# Altium schematic sheet current_stabilizer.SchDoc: Stabilizer Current Sense Mezzanine
size A3; DocumentNumber: 1; SheetNumber: 1; SheetTotal: 5
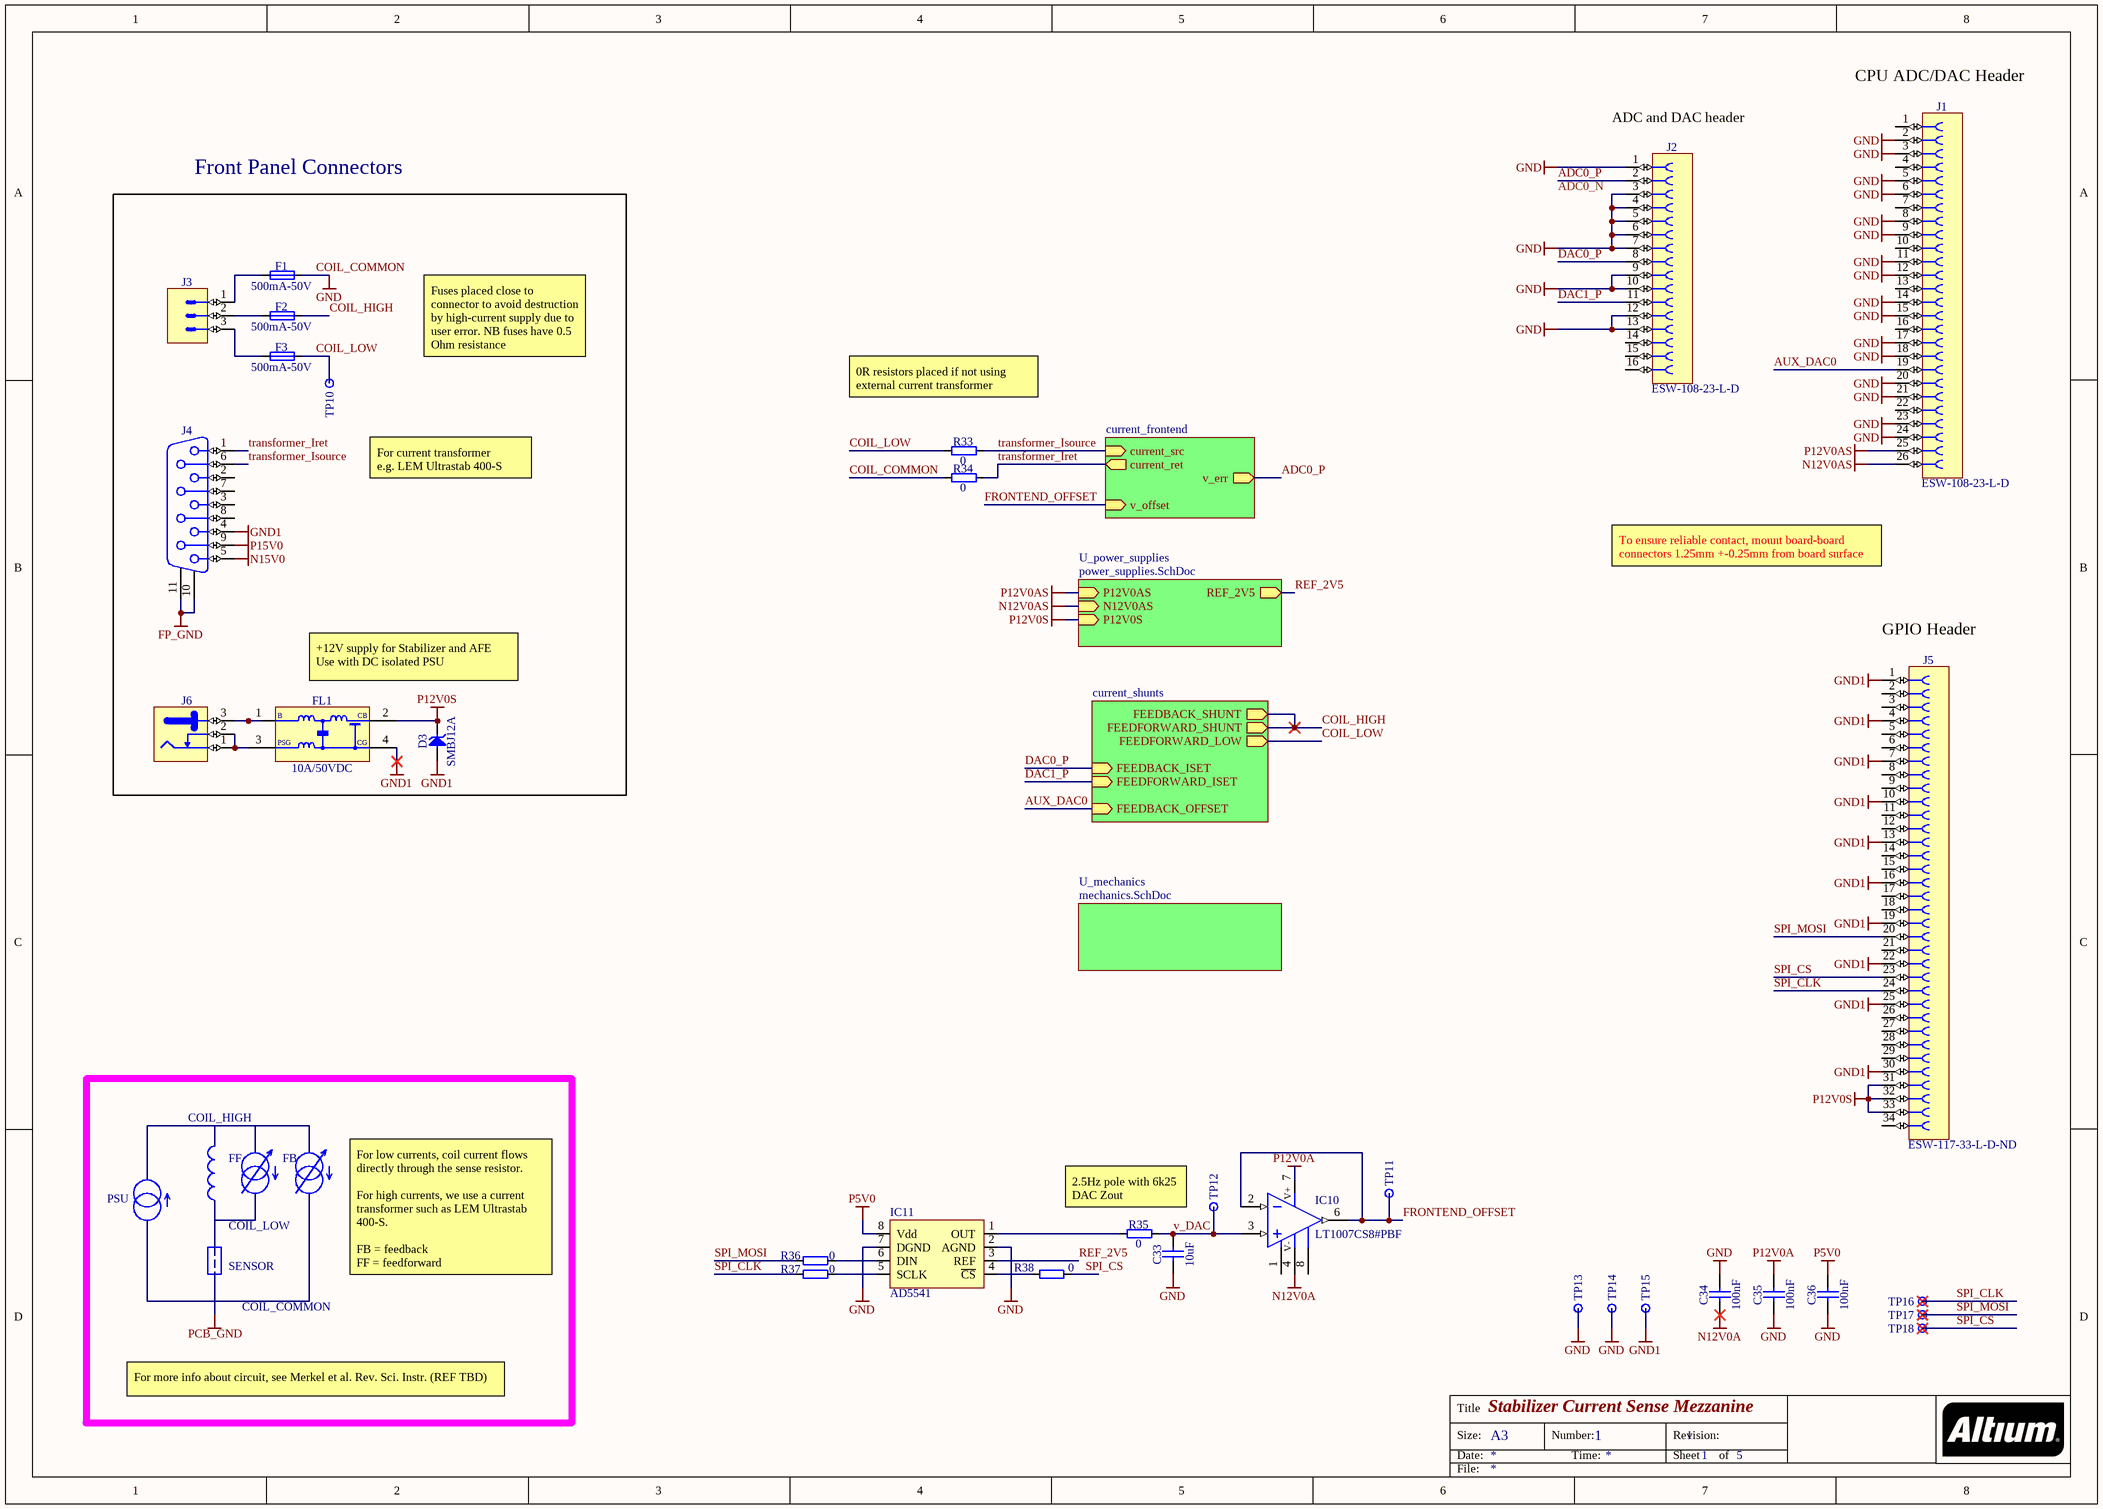
[diagram p0: current_stabilizer.SchDoc]

## Parts
C33  10uF  [CAPC2012X95N]
C34  100nF  [CAPC1608X87N]
C35  100nF  [CAPC1608X87N]
C36  100nF  [CAPC1608X87N]
D3  SMBJ12A  [DIOM5336X265N]
F1  500mA-50V  [FUSC1608X55N]
F2  500mA-50V  [FUSC1608X55N]
F3  500mA-50V  [FUSC1608X55N]
FL1  10A/50VDC  [FIL_MURATA_BNX02]
IC10  LT1007CS8#PBF  [SOIC127P600X175-8N]
IC11  AD5541  [so-8]
J1  ESW-108-23-L-D  [ESW-113-23-L-D]
J2  ESW-108-23-L-D  [ESW-108-23-L-D]
J3  MSTBA  [PHOENIX_1757255]  (value not drawn)
J4  D-Sub 9F  [FCI_D09S13A4GV00LF]  (value not drawn)
J5  Manufacturer Part Number: ESW-117-33-L-D-ND  [ESW-117-23-L-D]  (hidden comment: ESW-108-23-L-D)
J6  Jack  [SWITCHCRAFT_L712RA]  (value not drawn)
R33  0  [RESC1608X55N]
R34  0  [RESC1608X55N]
R35  0  [RESC1608X55N]
R36  0  [RESC1608X55N]
R37  0  [RESC1608X55N]
R38  0  [RESC1608X55N]
TP10  Test Point  [TPS127]  (value not drawn)
TP11  Test Point  [TPS127]  (value not drawn)
TP12  Test Point  [TPS127]  (value not drawn)
TP13  Test Point  [TPS127]  (value not drawn)
TP14  Test Point  [TPS127]  (value not drawn)
TP15  Test Point  [TPS127]  (value not drawn)
TP16  Test Point  [TPS127]  (value not drawn)
TP17  Test Point  [TPS127]  (value not drawn)
TP18  Test Point  [TPS127]  (value not drawn)

## Blocks framed on the sheet
Front Panel Connectors: D3 F1-F3 FL1 J3 J4 J6 TP10

## Sub-sheets
current_frontend = current_frontend: v_err (out), v_offset (in), current_src (in), current_ret (out)
Designator = current_shunts: FEEDFORWARD_ISET (in), FEEDBACK_ISET (in), FEEDFORWARD_SHUNT (out), FEEDBACK_SHUNT (out), FEEDBACK_OFFSET (in), FEEDFORWARD_LOW (out)
U_mechanics = mechanics.SchDoc: no entries
U_power_supplies = power_supplies.SchDoc: REF_2V5 (out), P12V0AS (in), N12V0AS (in), P12V0S (in)

## Nets
COIL_COMMON: C33.1 C34.2 C35.1 C36.1 F1.1 IC11.2(AGND) IC11.7(DGND) J1.2 J1.3 J1.5 J1.6 J1.8 J1.9 J1.11 J1.12 J1.14 J1.15 J1.17 J1.18 J1.20 J1.21 J1.23 J1.24 J2.1 J2.3 J2.4 J2.5 J2.6 J2.7 J2.9 J2.10 J2.12 J2.13 R34.1 TP13.1 TP14.1  [also labelled GND]
FP_GND: J4.10 J4.11
GND1: D3.2(A) FL1.4(CG) J4.4 J5.1 J5.4 J5.7 J5.10 J5.13 J5.16 J5.19 J5.22 J5.25 J5.30 TP15.1
N12V0A: C34.1 IC10.4(V-)
N12V0AS: J1.26 ; sheet U_power_supplies/N12V0AS
N15V0: J4.5
P5V0: C36.2 IC11.8(Vdd)
P12V0A: C35.2 IC10.7(V+)
P12V0AS: J1.25 ; sheet U_power_supplies/P12V0AS
P12V0S: D3.1(C) FL1.2(CB) J5.31 J5.32 J5.33 ; sheet U_power_supplies/P12V0S
P15V0: J4.9
ADC0_P: J2.2 ; sheet current_frontend/v_err
AUX_DAC0: J1.19 ; sheet Designator/FEEDBACK_OFFSET
COIL_HIGH: F2.1 ; sheet Designator/FEEDFORWARD_SHUNT, sheet Designator/FEEDBACK_SHUNT
COIL_LOW: F3.1 R33.1 TP10.1 ; sheet Designator/FEEDFORWARD_LOW
DAC0_P: J2.8 ; sheet Designator/FEEDBACK_ISET
DAC1_P: J2.11 ; sheet Designator/FEEDFORWARD_ISET
FRONTEND_OFFSET: IC10.2(IN-) IC10.6(OUT) TP11.1 ; sheet current_frontend/v_offset
REF_2V5: IC11.3(REF) ; sheet U_power_supplies/REF_2V5
SPI_CLK: J5.24 R37.1 TP16.1
SPI_CS: J5.23 R38.2 TP18.1
SPI_MOSI: J5.20 R36.1 TP17.1
transformer_Iret: J4.1 R34.2 ; sheet current_frontend/current_ret
transformer_Isource: J4.6 R33.2 ; sheet current_frontend/current_src
v_DAC: C33.2 IC10.3(IN+) R35.2 TP12.1
NetF1_2: F1.2 J3.1
NetF2_2: F2.2 J3.2
NetF3_2: F3.2 J3.3
NetFL1_1: FL1.1(B) J6.3
NetFL1_3: FL1.3(PSG) J6.1 J6.2
NetIC11_1: IC11.1(OUT) R35.1
NetIC11_4: IC11.4(~{CS}) R38.1
NetIC11_5: IC11.5(SCLK) R37.2
NetIC11_6: IC11.6(DIN) R36.2

Not connected (* = marked no-connect by the designer): IC10 1(OFFSET) 8(OFFSET); J1 1 4 7 10 13 16 22; J2 14 15 16; J4 2 3 7 8; J5 2 3 5 6 8 9 11 12 14 15 17 18 21 26 27 28 29 34

## Notes on the sheet
- (near J1) CPU ADC/DAC Header
- (near J2) ADC and DAC header
- ADC0_N
- Fuses placed close to connector to avoid destruction by high-current supply due to user error. NB fuses have 0.5 Ohm resistance
- 0R resistors placed if not using external current transformer
- For current transformer
  e.g. LEM Ultrastab 400-S
- To ensure reliable contact, mount board-board connectors 1.25mm +-0.25mm from board surface
- (near J5) GPIO Header
- +12V supply for Stabilizer and AFE
  Use with DC isolated PSU
- COIL_HIGH
- FF
- FB
- PSU
- COIL_LOW
- 2.5Hz pole with 6k25 DAC Zout
- SENSOR
- COIL_COMMON
- For low currents, coil current flows directly through the sense resistor.
  For high currents, we use a current transformer such as LEM Ultrastab 400-S.
  FB = feedback
  FF = feedforward
- For more info about circuit, see Merkel et al. Rev. Sci. Instr. (REF TBD)
- PCB_GND
- Title
- Size:
- Date:
- A3
- Number:
- Time:
- Revision:
- Sheet
- of
- File:

## Library data of the parts
C33 = CC0805_10UF_25V_10%_X5R: Non-polarised capacitor; Part Description: SMD Multilayer Chip Ceramic Capacitor; Manufacturer: GENERIC; Manufacturer1 Part Number: GRM219R61E106KA12D; Voltage: 25V; TC: X5R; Tolerance: ±10%; Part Number: CC0805_10UF_25V_10%_X5R; Component Kind: Standard; Component Type: Standard; Pin Count: 2; Value: 10uF; Status: Preferred; Manufacturer Part Number: CC0805_10UF_25V_10%_X5R; Case: 0805; Mounted: Yes; Socket: No; SMD: Yes; Sense: No; Manufacturer1 Example: MURATA; Manufacturer1 ComponentHeight: 0.95mm; HelpURL: \\cern.ch\dfs\Applications\Altium\Datasheets\CC0805_X5R_MURATA_GRM.pdf; Author: CERN DEM JLC; CreateDate: 25/10/2012; LatestRevisionDate: 06/09/2016
C34-C36 = CC0603_100NF_50V_10%_X7R: Non-polarised capacitor; Part Description: SMD Multilayer Chip Ceramic Capacitor; Manufacturer: GENERIC; Manufacturer1 Part Number: 223858615649; Voltage: 50V; TC: X7R; Tolerance: ±10%; Part Number: CC0603_100NF_50V_10%_X7R; Component Kind: Standard; Component Type: Standard; Pin Count: 2; Value: 100nF; Status: Preferred; Manufacturer Part Number: CC0603_100NF_50V_10%_X7R; Case: 0603; Mounted: Yes; Socket: No; SMD: Yes; Sense: No; Manufacturer1 Example: PHYCOMP; Manufacturer1 ComponentHeight: 0.87mm; HelpURL: \\cern.ch\dfs\Applications\Altium\Datasheets\CC0603_X7R_PHYCOMP.pdf; Author: CERN DEM JLC; CreateDate: 03/12/2007; LatestRevisionDate: 03/12/2007
D3 = SMBJ12A: Zener Diode; Part Description: Uni-Directional Transient Voltage Suppressor Diode; Manufacturer: FAIRCHILD SEMICONDUCTOR; Voltage: 12V; Power: 600W; PressFit: No; Bonding: No; Part Number: SMBJ12A; Component Kind: Standard; Component Type: Standard; Device: SMBJ12A; PackageDescription: DO-214-AA/SMB Diode, Molded Body; 5.34mm L X 3.625mm W X 2.65mm H, IPC Medium Density; Manufacturer Part Number: SMBJ12A; Pin Count: 2; Case: DO-214AA; Mounted: Yes; Socket: No; SMD: Yes; Sense: No; ComponentHeight: 2.65mm; HelpURL: \\cern.ch\dfs\Applications\Altium\Datasheets\SMBJ.pdf; Author: CERN DEM JLC; CreateDate: 10/04/2013; LatestRevisionDate: 10/04/2013
F1-F3 = FUS0603_BOURNS-SF-0603F050-2: Fuse; Part Description: Thin Film Chip Fuse; Manufacturer: BOURNS; PressFit: No; Part Number: FUS0603_BOURNS-SF-0603F050-2; Component Kind: Standard; Component Type: Standard; Pin Count: 2; PackageDescription: Chip Fuse, 2-Leads, Body 1.6mm x 0.8mm, IPC Medium Density; Family: Fuse; Mounted: Yes; Socket: No; SMD: Yes; Sense: No; Value: 500mA-50V; Manufacturer Part Number: SF-0603F050-2; ComponentHeight: 0.55mm; HelpURL: \\cern.ch\dfs\Applications\Altium\Datasheets\FUSE_BOURNS_SF-0603F.pdf; Author: CERN DEM JLC; CreateDate: 01/02/2017; LatestRevisionDate: 01/02/2017
FL1 = FIL_MURATA_BNX022-01L: Block Type EMIFIL (LC Combined); Part Description: Block Type EMIFIL (LC Combined) SMD Type, BNX02* Series; Manufacturer: MURATA; Resistance: 0.5R; Part Number: FIL_MURATA_BNX022-01L; Component Kind: Standard; Component Type: Standard; Pin Count: 2; Value: 10A/50VDC; Status: None; Manufacturer Part Number: BNX022-01L; Mounted: Yes; Socket: No; SMD: Yes; Sense: No; ComponentHeight: 3.3mm; HelpURL: \\cern.ch\dfs\Applications\Altium\Datasheets\FIL_MURATA_BNX022-01L.pdf; Author: CERN DEM JLC; CreateDate: 10/10/2012; LatestRevisionDate: 10/10/2012
IC10 = LT1007CS8#PBF: Operational Amplifier with Offset 1-8; Part Description: Low Noise, High Speed Precision Operational Amplifier; Manufacturer: LINEAR TECHNOLOGY; PressFit: No; Bonding: No; Part Number: LT1007CS8#PBF; Component Kind: Standard; Component Type: Standard; Device: LT1007CS8#PBF; PackageDescription: SOIC 8, Pitch 1.27mm - Body 4x5mm, IPC Medium Density; Manufacturer Part Number: LT1007CS8#PBF; Pin Count: 7; Case: SOIC8; Mounted: Yes; Socket: No; SMD: Yes; Sense: No; ComponentHeight: 1.75mm; Author: CERN DEM JLC; HelpURL: \\cern.ch\dfs\Applications\Altium\Datasheets\LT1007CS8#PBF.pdf; CreateDate: 09/03/2011; LatestRevisionDate: 09/03/2011
IC11 = AD5541LRZ: 16 bit serial DAC; Manufacturer: ANALOG DEVICES; Manufacturer Part Number: AD5541LRZ
J1 = ESW-113-23-L-D: Connector Elevated Socket 26 POS 2.54mm, 13.59mm height; Manufacturer: Samtec; Manufacturer Part Number: ESW-108-23-L-D
J2 = ESW-108-23-L-D: Connector Elevated Socket 16 POS 2.54mm, 13.59mm height; Manufacturer: Samtec; Manufacturer Part Number: ESW-108-23-L-D
J3 = PHOENIX_1757255: Connector 3 Male; Part Description: 12A, 250V, Pitch 5.08mm, 3 Positions Header; Manufacturer: PHOENIX CONTACT; Manufacturer Part Number: 1757255 (MSTBA 2,5/ 3-G-5,08); PressFit: No; Part Number: PHOENIX_1757255; Component Kind: Standard; Component Type: Standard; Pin Count: 3; Mounted: Yes; Socket: No; SMD: No; Sense: No; Status: None; ComponentHeight: 8.6mm; HelpURL: \\cern.ch\dfs\Applications\Altium\Datasheets\PHOENIX_1757255.pdf; Author: CERN DEM JLC; CreateDate: 10/02/2010; LatestRevisionDate: 26/04/2010; Family: MSTBA
J4 = FCI_D09S13A4GV00LF: Connector D-sub 9 Female; Part Description: Right Angled D-SUB 9 Female Contacts for PCB  with Harpoons and Female Screwlock (UNC4-40) and Elec. Continuity; Manufacturer: FCI; PressFit: No; Part Number: FCI_D09S13A4GV00LF; Component Kind: Standard; Component Type: Standard; Pin Count: 11; Family: D-Sub 9F; Mounted: Yes; Socket: No; SMD: No; Sense: No; Status: None; Manufacturer Part Number: D09S13A4GV00LF; ComponentHeight: 13.86mm; HelpURL: \\cern.ch\dfs\Applications\Altium\Datasheets\FCI_D09S13A4GV00LF.pdf; Author: CERN DEM JLC; CreateDate: 04/10/2017; LatestRevisionDate: 04/10/2017
J5 = ESW-117-23-L-D: Connector Elevated Socket 34 POS 2.54mm, 13.59mm height; Manufacturer: Samtec
J6 = SWITCHCRAFT_L712RA: 24V /3. 5A, 2.1mm Diameter Pin, SMD DC Power Supply Connector With  Break Contact; Part Description: 12V/5A, 2.5mm Diameter Pin, THT DC Power Supply Connector With  Break Contact; Manufacturer Part Number: L712RA; PressFit: No; Part Number: SWITCHCRAFT_L712RA; Component Kind: Standard; Component Type: Standard; Pin Count: 3; Family: Jack; Mounted: Yes; Socket: No; SMD: No; Sense: No; Status: None; Manufacturer: SWITCHCRAFT; ComponentHeight: 11mm; HelpURL: \\cern.ch\dfs\Applications\Altium\Datasheets\LUMBERG_161314.pdf; Author: GK; CreateDate: 15.02.2011; LatestRevisionDate: 20.07.2011
R33-R38 = R0603_0R_JUMPER: Resistor; Part Description: 1A (0.05R Max DC Resistance) Zero Ohm Jumper; Manufacturer: GENERIC; Manufacturer1 Part Number: NRC06Z0; PressFit: No; Part Number: R0603_0R_JUMPER; Component Kind: Standard; Component Type: Standard; Pin Count: 2; Value: 0; Status: Preferred; Manufacturer Part Number: R0603_0R_JUMPER; Case: 0603; Mounted: Yes; Sense: No; Socket: No; SMD: Yes; Manufacturer1 Example: NIC COMPONENT; Manufacturer1 ComponentHeight: 0.55mm; HelpURL: \\cern.ch\dfs\Applications\Altium\Datasheets\R0603_NIC_NRC.pdf; Author: CERN DEM JLC; CreateDate: 03/12/2007; LatestRevisionDate: 13/03/2008
TP10-TP18 = SMD_PAD_1.27X1.27MM: Part Description: 1.27mm x 1.27mm PCB Copper Area (SMD Test Point); Mounted: No; Part Number: SMD_PAD_1.27X1.27MM; Component Kind: Standard (No BOM); Component Type: Standard (No BOM); Pin Count: 1; Family: Test Point; Socket: No; SMD: Yes; Sense: No; Status: None; ComponentHeight: 0mm; HelpURL: Undefined; Author: CERN DEM JLC; CreateDate: 12/01/2008; LatestRevisionDate: 12/01/2008; PackageDescription: 1.27mm x 1.27mm PCB Copper Area (SMD Test Point)